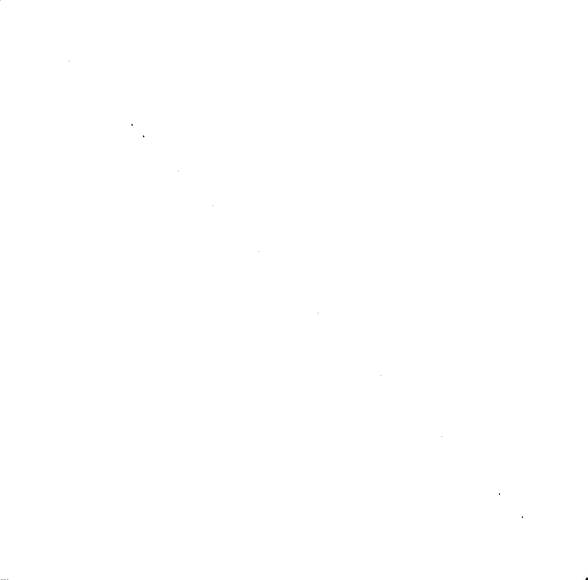
[diagram p0: schematic Draft2.asc]
Draft2.asc, the LTspice schematic file:
Version 4.1
SHEET 1 880 680
WIRE 368 -64 48 -64
WIRE 368 -16 368 -64
WIRE 368 -16 224 -16
WIRE 480 -16 368 -16
WIRE 48 0 48 -64
WIRE 480 0 480 -16
WIRE 224 16 224 -16
WIRE 528 80 480 80
WIRE 48 128 48 80
WIRE 432 128 336 128
WIRE 224 208 224 96
WIRE 336 208 224 208
WIRE 224 224 224 208
WIRE 528 224 528 80
WIRE 400 304 224 304
WIRE 528 304 400 304
WIRE 48 368 48 208
WIRE 400 368 400 304
WIRE 400 368 48 368
FLAG -864544 -865232 0
FLAG -871344 -872048 0
FLAG -888368 -889056 0
FLAG -922416 -923104 0
FLAG -970064 -970752 0
FLAG -993904 -994592 0
FLAG -1007520 -1008208 0
FLAG -1017728 -1018416 0
FLAG -1027936 -1028624 0
FLAG -1031344 -1032032 0
FLAG -1109632 -1110320 0
FLAG -1181120 -1181808 0
SYMBOL voltage 48 112 R0
SYMATTR InstName V2
SYMATTR Value 117
SYMBOL res 208 0 R0
SYMATTR InstName R3
SYMATTR Value 14
SYMBOL res 464 -16 R0
SYMATTR InstName R4
SYMATTR Value 37
SYMBOL res 208 208 R0
SYMATTR InstName R5
SYMATTR Value 5
SYMBOL res 512 208 R0
SYMATTR InstName R6
SYMATTR Value 12
SYMBOL res 320 112 R0
SYMATTR InstName R1
SYMATTR Value 22
SYMBOL voltage 432 112 R0
SYMATTR InstName V1
SYMATTR Value 136
SYMBOL res 32 -16 R0
SYMATTR InstName R2
SYMATTR Value 20
TEXT -1181136 376 Left 2 !.tran 1

The netlist it stands for:
* Draft2.asc
V2 N003 N006 117
R3 N001 N005 14
R4 N001 N002 37
R5 N005 N006 5
R6 N002 N006 12
R1 N004 N005 22
V1 N004 NC_01 136
R2 N001 N003 20
.tran 1
.backanno
.end